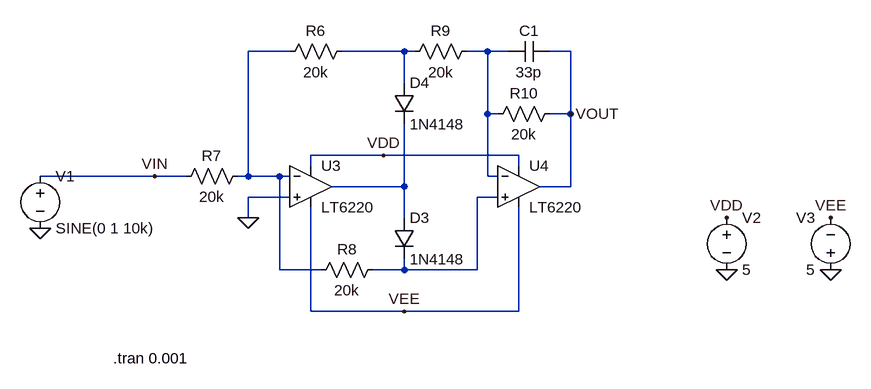
[diagram p0: schematic test.asc]
test.asc, the LTspice schematic file:
Version 4
SHEET 1 2376 680
WIRE -80 -16 -144 -16
WIRE 96 -16 0 -16
WIRE 112 -16 96 -16
WIRE 224 -16 192 -16
WIRE 256 -16 224 -16
WIRE 352 -16 320 -16
WIRE 96 32 96 -16
WIRE 224 80 224 -16
WIRE 240 80 224 80
WIRE 352 80 352 -16
WIRE 352 80 320 80
WIRE 64 144 -48 144
WIRE 272 144 64 144
WIRE -48 160 -48 144
WIRE 272 160 272 144
WIRE -288 176 -464 176
WIRE -240 176 -288 176
WIRE -144 176 -144 -16
WIRE -144 176 -160 176
WIRE -96 176 -144 176
WIRE -80 176 -96 176
WIRE 224 176 224 80
WIRE 240 176 224 176
WIRE 96 192 96 96
WIRE 96 192 -16 192
WIRE 352 192 352 80
WIRE 352 192 304 192
WIRE -80 208 -144 208
WIRE 240 208 208 208
WIRE -144 240 -144 208
WIRE 96 240 96 192
WIRE -96 320 -96 176
WIRE -32 320 -96 320
WIRE 96 320 96 304
WIRE 96 320 48 320
WIRE 208 320 208 208
WIRE 208 320 96 320
WIRE -48 384 -48 224
WIRE 96 384 -48 384
WIRE 272 384 272 224
WIRE 272 384 96 384
FLAG -144 240 0
FLAG 352 80 VOUT
FLAG -288 176 VIN
FLAG 64 144 VDD
FLAG 96 384 VEE
FLAG -464 256 0
FLAG 592 320 0
FLAG 752 320 0
FLAG 592 240 VDD
FLAG 752 240 VEE
SYMBOL diode 80 240 R0
SYMATTR InstName D3
SYMATTR Value 1N4148
SYMBOL diode 80 32 R0
SYMATTR InstName D4
SYMATTR Value 1N4148
SYMBOL res 16 -32 R90
WINDOW 0 0 56 VBottom 2
WINDOW 3 32 56 VTop 2
SYMATTR InstName R6
SYMATTR Value 20k
SYMBOL res -144 160 R90
WINDOW 0 0 56 VBottom 2
WINDOW 3 32 56 VTop 2
SYMATTR InstName R7
SYMATTR Value 20k
SYMBOL res 224 96 R270
WINDOW 0 32 56 VTop 2
WINDOW 3 0 56 VBottom 2
SYMATTR InstName R10
SYMATTR Value 20k
SYMBOL res 64 304 R90
WINDOW 0 0 56 VBottom 2
WINDOW 3 32 56 VTop 2
SYMATTR InstName R8
SYMATTR Value 20k
SYMBOL res 208 -32 R90
WINDOW 0 0 56 VBottom 2
WINDOW 3 32 56 VTop 2
SYMATTR InstName R9
SYMATTR Value 20k
SYMBOL Opamps\\LT6220 -48 192 R0
SYMATTR InstName U3
SYMBOL Opamps\\LT6220 272 192 R0
SYMATTR InstName U4
SYMBOL voltage -464 160 R0
WINDOW 123 0 0 Left 0
WINDOW 39 0 0 Left 0
SYMATTR InstName V1
SYMATTR Value SINE(0 1 10k)
SYMBOL voltage 592 224 R0
SYMATTR InstName V2
SYMATTR Value 5
SYMBOL voltage 752 336 R180
WINDOW 0 24 96 Left 2
WINDOW 3 24 16 Left 2
SYMATTR InstName V3
SYMATTR Value 5
SYMBOL cap 320 -32 R90
WINDOW 0 0 32 VBottom 2
WINDOW 3 32 32 VTop 2
SYMATTR InstName C1
SYMATTR Value 33p
TEXT -352 456 Left 2 !.tran 0.001

The netlist it stands for:
* test.asc
D3 N004 N005 1N4148
D4 N002 N004 1N4148
R6 N002 N001 20k
R7 N001 VIN 20k
R10 N003 VOUT 20k
R8 N005 N001 20k
R9 N003 N002 20k
XU3 0 N001 VDD VEE N004 LT6220  ; pins In+ In- V+ V- OUT
XU4 N005 N003 VDD VEE VOUT LT6220  ; pins In+ In- V+ V- OUT
V1 VIN 0 SINE(0 1 10k)
V2 VDD 0 5
V3 0 VEE 5
C1 VOUT N003 33p
.model D D
.lib standard.dio
.tran 0.001
.lib LTC4.lib
.backanno
.end

* Results of the author's LTspice run, read from the files saved beside the schematic
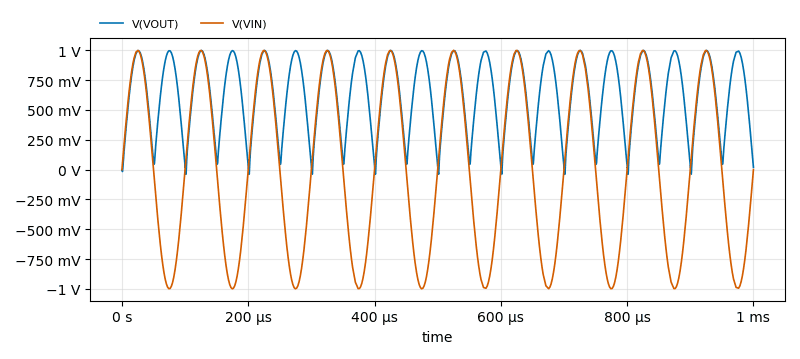
[diagram p1: Transient Analysis of test.asc, plotted from the saved traces]
* Transient Analysis, 1 run:
*   V(VOUT): min -39.05 mV, max 999 mV, average 633.6 mV, rms 705.4 mV, last 19.04 mV
*   V(VIN): min -999.7 mV, max 999.9 mV, average 72.66 µV, rms 706.4 mV, last 0 V